# Altium schematic sheet Smartlock.SchDoc
size A4; SheetNumber: 1; SheetTotal: 1
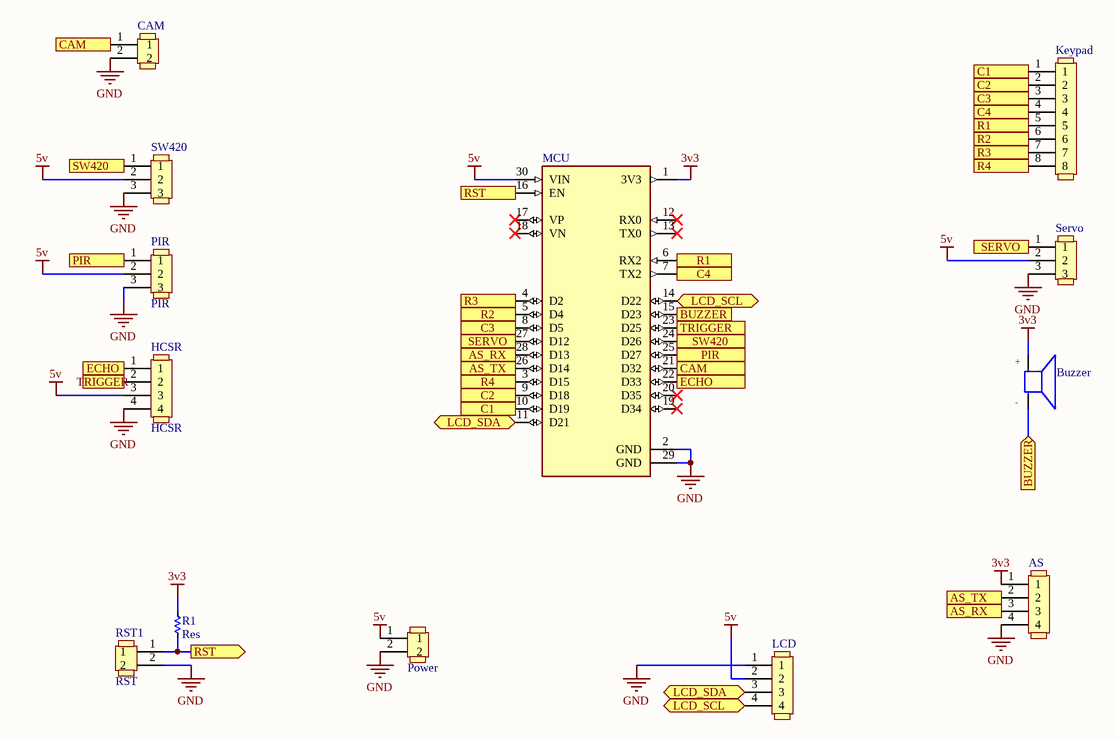
[diagram p0: Smartlock.SchDoc]

## Parts
AS  Header_4  [HEADER_4_2P54_SHROUDED]  (value not drawn)
Buzzer  AI-1223-TWT-5V-R  [XDCR_AI-1223-TWT-5V-R]  (value not drawn)
CAM  CONN HEADER VERT 2POS 2.5MM  [HEADER_2]  (value not drawn)
HCSR  HCSR  [HEADER_4_2P54_SHROUDED]
Keypad  Header_8  [HEADER_8_2P54_SHROUDED]  (value not drawn)
LCD  Header_4  [HEADER_4_2P54_SHROUDED]  (value not drawn)
MCU  ESP32-DEVKIT-V1  [MODULE_ESP32-DEVKITV1]  (value not drawn)
PIR  PIR  [HEADER_3_2P54_SHROUDED]
Power?  Power  [HEADER_2]
R1  Res  [RES-1/8W]
RST1  RST  [HEADER_2]
Servo  Header_3_2p54_shrouded  [HEADER_3_2P54_SHROUDED]  (value not drawn)
SW420  Header_3_2p54_shrouded  [HEADER_3_2P54_SHROUDED]  (value not drawn)

## Ports
AS_RX (in), AS_RX (out), AS_TX (in), AS_TX (out), BUZZER (in), BUZZER (out), C1 (in), C1 (out), C2 (in), C2 (out), C3 (in), C3 (out), C4 (in), CAM (in), CAM (out), ECHO, ECHO (out), LCD_SCL (bidir), LCD_SDA (bidir), PIR (in), PIR (out), R1 (out), R2 (in), R2 (out), R3 (in), R3 (out), R4 (in), R4 (out), RST (in), RST (out), SERVO (in), SERVO (out), SW420 (in), SW420 (out), TRIGGER, TRIGGER (in)

## Nets
3v3: AS.1 Buzzer.P(POS) MCU.1(3V3) R1.1
5v: HCSR.3 LCD.2 MCU.30(VIN) PIR.2 Power?.1 Servo.2 SW420.2
GND: AS.4 CAM.2 HCSR.4 LCD.1 MCU.2(GND) MCU.29(GND) PIR.3 Power?.2 RST1.2 Servo.3 SW420.3
AS_RX: AS.3 MCU.28(D13) ; port AS_RX
AS_TX: AS.2 MCU.26(D14) ; port AS_TX
BUZZER: Buzzer.N(NEG) MCU.15(D23) ; port BUZZER
C1: Keypad.1 MCU.10(D19) ; port C1
C2: Keypad.2 MCU.9(D18) ; port C2
C3: Keypad.3 MCU.8(D5) ; port C3
C4: Keypad.4 MCU.7(TX2) ; port C4
CAM: CAM.1 MCU.21(D32) ; port CAM
ECHO: HCSR.1 MCU.22(D33) ; port ECHO
LCD_SCL: LCD.4 MCU.14(D22) ; port LCD_SCL
LCD_SDA: LCD.3 MCU.11(D21) ; port LCD_SDA
PIR: MCU.25(D27) PIR.1 ; port PIR
R1: Keypad.5 MCU.6(RX2) ; port R1
R2: Keypad.6 MCU.5(D4) ; port R2
R3: Keypad.7 MCU.4(D2) ; port R3
R4: Keypad.8 MCU.3(D15) ; port R4
RST: MCU.16(EN) R1.2 RST1.1 ; port RST
SERVO: MCU.27(D12) Servo.1 ; port SERVO
SW420: MCU.24(D26) SW420.1 ; port SW420
TRIGGER: HCSR.2 MCU.23(D25) ; port TRIGGER

Not connected (* = marked no-connect by the designer): MCU 12(RX0)* 13(TX0)* 17(VP)* 18(VN)* 19(D34)* 20(D35)*

## Notes on the sheet
- (in symbol AI-1223-TWT-5V-R) +; -

## Library data of the parts
AS HCSR LCD = Header_4: Part Code: S1900-000023; Point: 4; Manufacturer: *; Part Number: *; Value: *; Description SEL: Header_4; Footprint Type: TH
Buzzer = AI-1223-TWT-5V-R: MF: {'manufacturer': u'PUI Audio,'}; Package: None; MP: AI-1223-TWT-5V-R; Value: *; Availability: Unavailable; Price: None
CAM = Header_2: Part Code: S1900-000037; Manufacturer: JST Sales America Inc.; Part Number: B2B-XH-A(LF)(SN); Point: 2; Value: Header_2; Description SEL: CONN HEADER VERT 2POS 2.5MM; Footprint Type: TH
Keypad = Header_8: Part Code: S1900-000027; Point: 8; Manufacturer: *; Part Number: *; Value: *; Description SEL: Header_8; Footprint Type: TH
MCU = ESP32-DEVKIT-V1: Dual core, Wi-Fi: 2.4 GHz up to 150 Mbits/s,BLE (Bluetooth Low Energy) and legacy Bluetooth, 32 bits, Up to 240 MHz; MF: {'manufacturer': u'Do it'}; MP: ESP32-DEVKIT-V1; Package: None; Price: None; Availability: Unavailable; Value: *
PIR Servo SW420 = Header_3_2p54_shrouded: Part Code: S1900-000021; Point: 3; Manufacturer: *; Part Number: *; Value: *; Description SEL: Header_3; Footprint Type: TH
Power? RST1 = Header_2: CONN HEADER VERT 2POS 2.5MM; Part Code: S1900-000037; Manufacturer: JST Sales America Inc.; Part Number: B2B-XH-A(LF)(SN); Point: 2; Value: Header_2; Description SEL: CONN HEADER VERT 2POS 2.5MM; Footprint Type: TH
R1 = Res: Manufacturer: Generic Components; Class: Passive; SubClass: R; Published: 08/06/2000; Publisher: Altium Hobart Technology Centre